# EasyEDA Pro project Optimus Prime.eprj

# Schematic Schematic1
Board Name: Board1; Create Date: 2025-09-30; Page Name: P1; Project Name: Optimus Prime; Schematic Name: Schematic1; Update Date: 2025-09-30; Company: EasyEDA.com; Page Size: A4; Version: V1.0
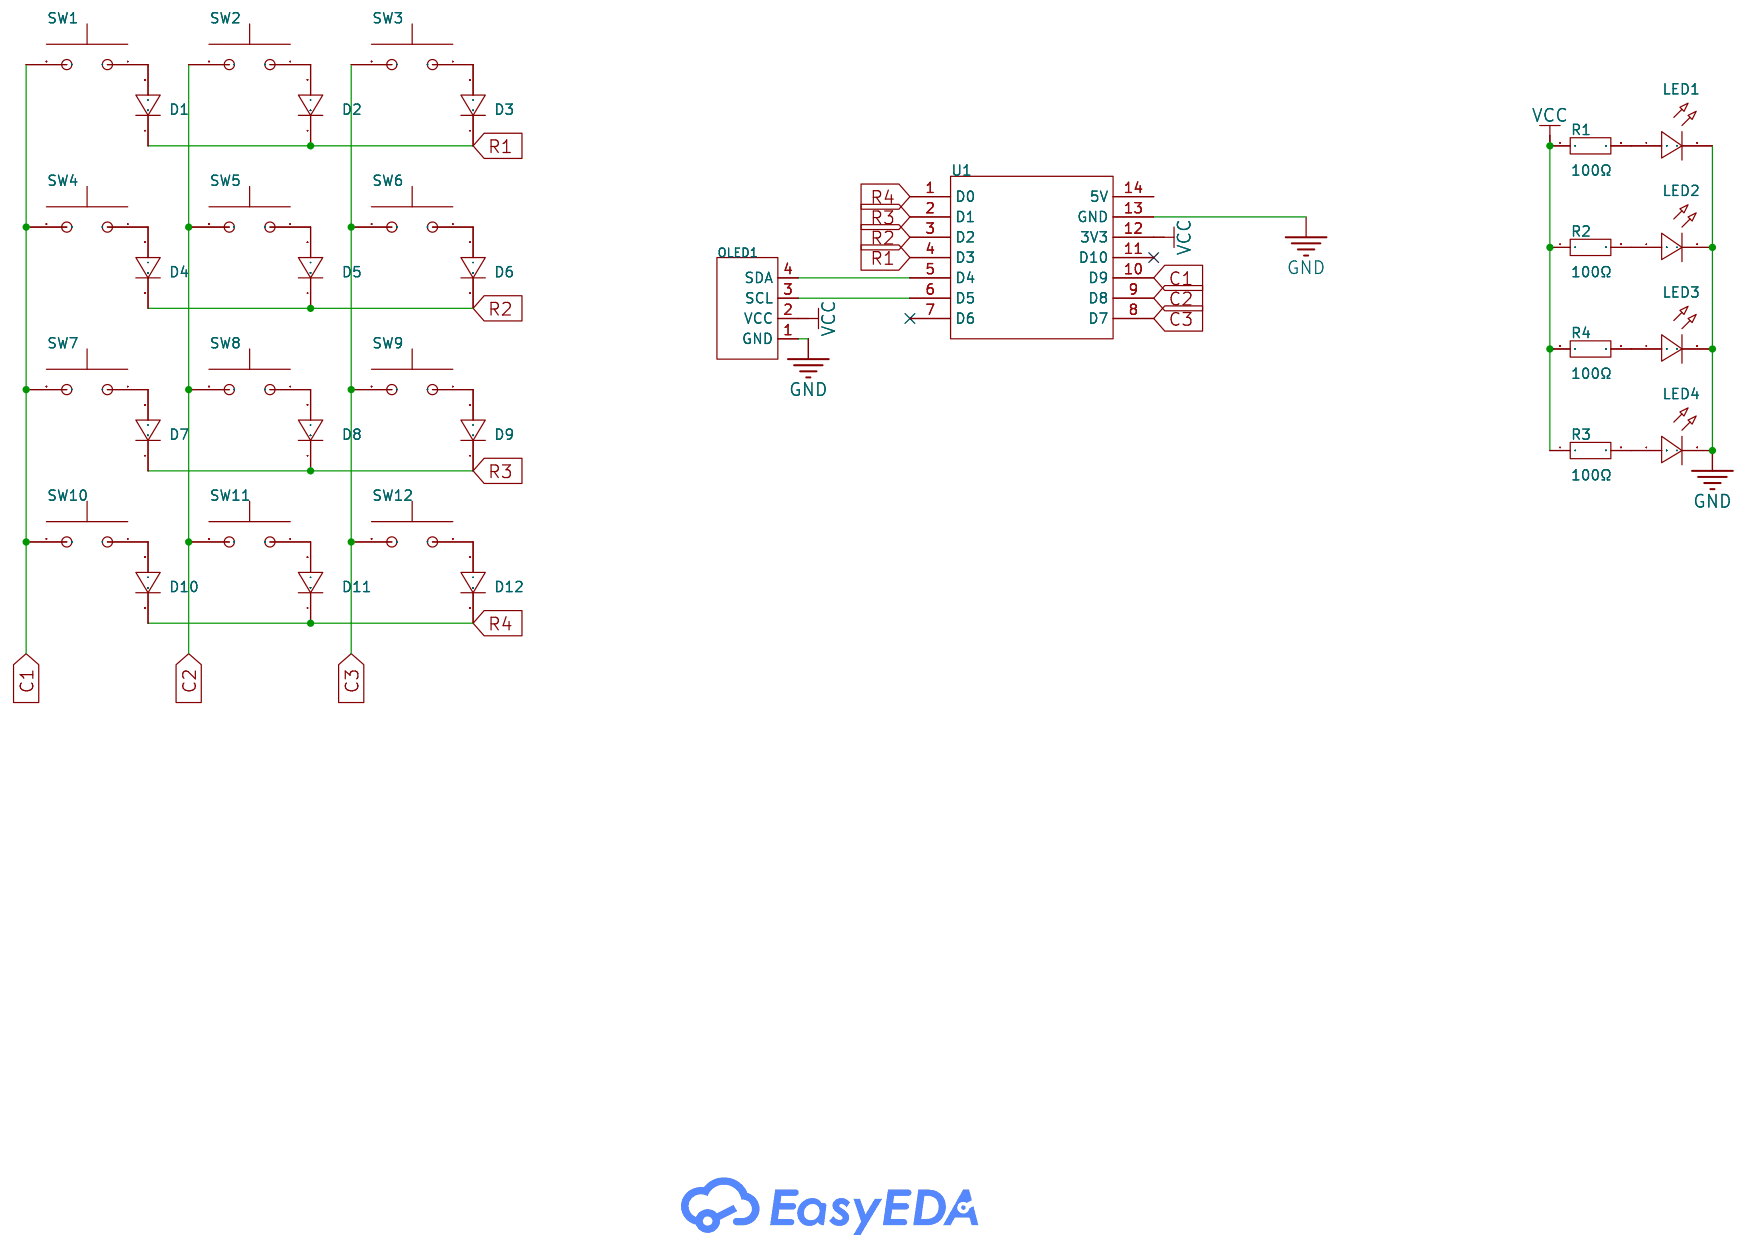
[diagram p0: schematic sheet]

## Parts
D1  1N4148TR  [DO-35_BD2.0-L4.2-P8.20-D0.5-RD]
D2  1N4148TR  [DO-35_BD2.0-L4.2-P8.20-D0.5-RD]
D3  1N4148TR  [DO-35_BD2.0-L4.2-P8.20-D0.5-RD]
D4  1N4148TR  [DO-35_BD2.0-L4.2-P8.20-D0.5-RD]
D5  1N4148TR  [DO-35_BD2.0-L4.2-P8.20-D0.5-RD]
D6  1N4148TR  [DO-35_BD2.0-L4.2-P8.20-D0.5-RD]
D7  1N4148TR  [DO-35_BD2.0-L4.2-P8.20-D0.5-RD]
D8  1N4148TR  [DO-35_BD2.0-L4.2-P8.20-D0.5-RD]
D9  1N4148TR  [DO-35_BD2.0-L4.2-P8.20-D0.5-RD]
D10  1N4148TR  [DO-35_BD2.0-L4.2-P8.20-D0.5-RD]
D11  1N4148TR  [DO-35_BD2.0-L4.2-P8.20-D0.5-RD]
D12  1N4148TR  [DO-35_BD2.0-L4.2-P8.20-D0.5-RD]
LED1  -  [LED-TH_BD3.0-P2.54-FD]
LED2  -  [LED-TH_BD3.0-P2.54-FD]
LED3  -  [LED-TH_BD3.0-P2.54-FD]
LED4  -  [LED-TH_BD3.0-P2.54-FD]
OLED1  HS91L02W2C01  [OLED-TH_L38.0-W12.0_HS91L02W2C01]
R1  100Ω  [RES-TH_BD1.8-L3.2-P7.20-D0.4]
R2  100Ω  [RES-TH_BD1.8-L3.2-P7.20-D0.4]
R3  100Ω  [RES-TH_BD1.8-L3.2-P7.20-D0.4]
R4  100Ω  [RES-TH_BD1.8-L3.2-P7.20-D0.4]
SW1  -  [MX_PCB_1.00u]
SW2  -  [MX_PCB_1.00u]
SW3  -  [MX_PCB_1.00u]
SW4  -  [MX_PCB_1.00u]
SW5  -  [MX_PCB_1.00u]
SW6  -  [MX_PCB_1.00u]
SW7  -  [MX_PCB_1.00u]
SW8  -  [MX_PCB_1.00u]
SW9  -  [MX_PCB_1.00u]
SW10  -  [MX_PCB_1.00u]
SW11  -  [MX_PCB_1.00u]
SW12  -  [MX_PCB_1.00u]
U1  -  [Seeed_XIAO_RP2040]

## Library data of the parts
D1-D12 = 1N4148TR: Diode Configuration:1个独立式 Voltage - Forward(Vf@If):1V@10mA Voltage - DC Reverse(Vr):75V Current - Rectified:300mA Pd - Power Dissipation:500mW Reverse Leakage Current (Ir):5uA@75V Reverse Recovery Time (trr):8ns Operating Junction Temperature Range:-65℃~+; Supplier Part: C84412; Manufacturer: VISHAY(威世); Supplier Footprint: DO-35; Datasheet: https://item.szlcsc.com/datasheet/1N4148TR/85582.html; Supplier: LCSC; Diode Configuration: 1个独立式; Voltage - Forward(Vf@If): 1V@10mA; Voltage - DC Reverse(Vr): 75V; Current - Rectified: 300mA; Pd - Power Dissipation: 500mW; Reverse Leakage Current (Ir): 5uA@75V; Reverse Recovery Time (trr): 8ns; Operating Junction Temperature Range: -65℃~+150℃@(Tj); Non-Repetitive Peak Forward Surge Current: 2A
LED1-LED4 = LED_TH-R_3mm: Supplier Footprint: Through
OLED1 = HS91L02W2C01: Main Control Chip:SSD1306 Interface Type:I2C Size:0.91 Pixel Resolution:128x32 Operating Temperature:-40℃~+70℃ Operating Temperature:-40℃~+70℃; LCSC Part Name: 0.91寸OLED显示屏白光IIC; Supplier Part: C5248081; Manufacturer: HS(汉昇); Datasheet: https://atta.szlcsc.com/upload/public/pdf/source/20230727/C3E43C8E3DDA847F5681FEE7D95C153D.pdf; Supplier: LCSC; Main Control Chip: SSD1306; Interface Type: I2C; Size: 0.91; Pixel Resolution: 128x32; Operating Temperature: -40℃~+70℃
R1-R4 = Res_AXIAL-1/8W: Supplier Footprint: Through
SW1-SW12 = MX_1.00U
U1 = MCU_XIAO_RP2040

## Nets
GND: LED1.2(A) LED2.2(A) LED3.2(A) LED4.2(A) OLED1.1(GND) U1.13(GND)
VCC: OLED1.2(VCC) R1.1 R2.1 R3.1 R4.1 U1.12(3V3)
C1: SW1.2 SW4.2 SW7.2 SW10.2 U1.10(D9)
C2: SW2.2 SW5.2 SW8.2 SW11.2 U1.9(D8)
C3: SW3.2 SW6.2 SW9.2 SW12.2 U1.8(D7)
R1: D1.1(C) D2.1(C) D3.1(C) U1.4(D3)
R2: D4.1(C) D5.1(C) D6.1(C) U1.3(D2)
R3: D7.1(C) D8.1(C) D9.1(C) U1.2(D1)
R4: D10.1(C) D11.1(C) D12.1(C) U1.1(D0)
$1N594: D1.2(A) SW1.1
$1N635: D2.2(A) SW2.1
$1N676: D3.2(A) SW3.1
$1N957: D4.2(A) SW4.1
$1N959: D5.2(A) SW5.1
$1N961: D6.2(A) SW6.1
$1N1080: D7.2(A) SW7.1
$1N1082: D8.2(A) SW8.1
$1N1092: D9.2(A) SW9.1
$1N1238: OLED1.4(SDA) U1.5(D4)
$1N1242: OLED1.3(SCL) U1.6(D5)
$1N1438: D10.2(A) SW10.1
$1N1440: D11.2(A) SW11.1
$1N1442: D12.2(A) SW12.1
$1N1843: LED1.1(C) R1.2
$1N1845: LED2.1(C) R2.2
$1N2019: LED3.1(C) R4.2
$1N2021: LED4.1(C) R3.2

Not connected (* = marked no-connect by the designer): U1 7(D6)* 11(D10)* 14(5V)

# Board PCB1
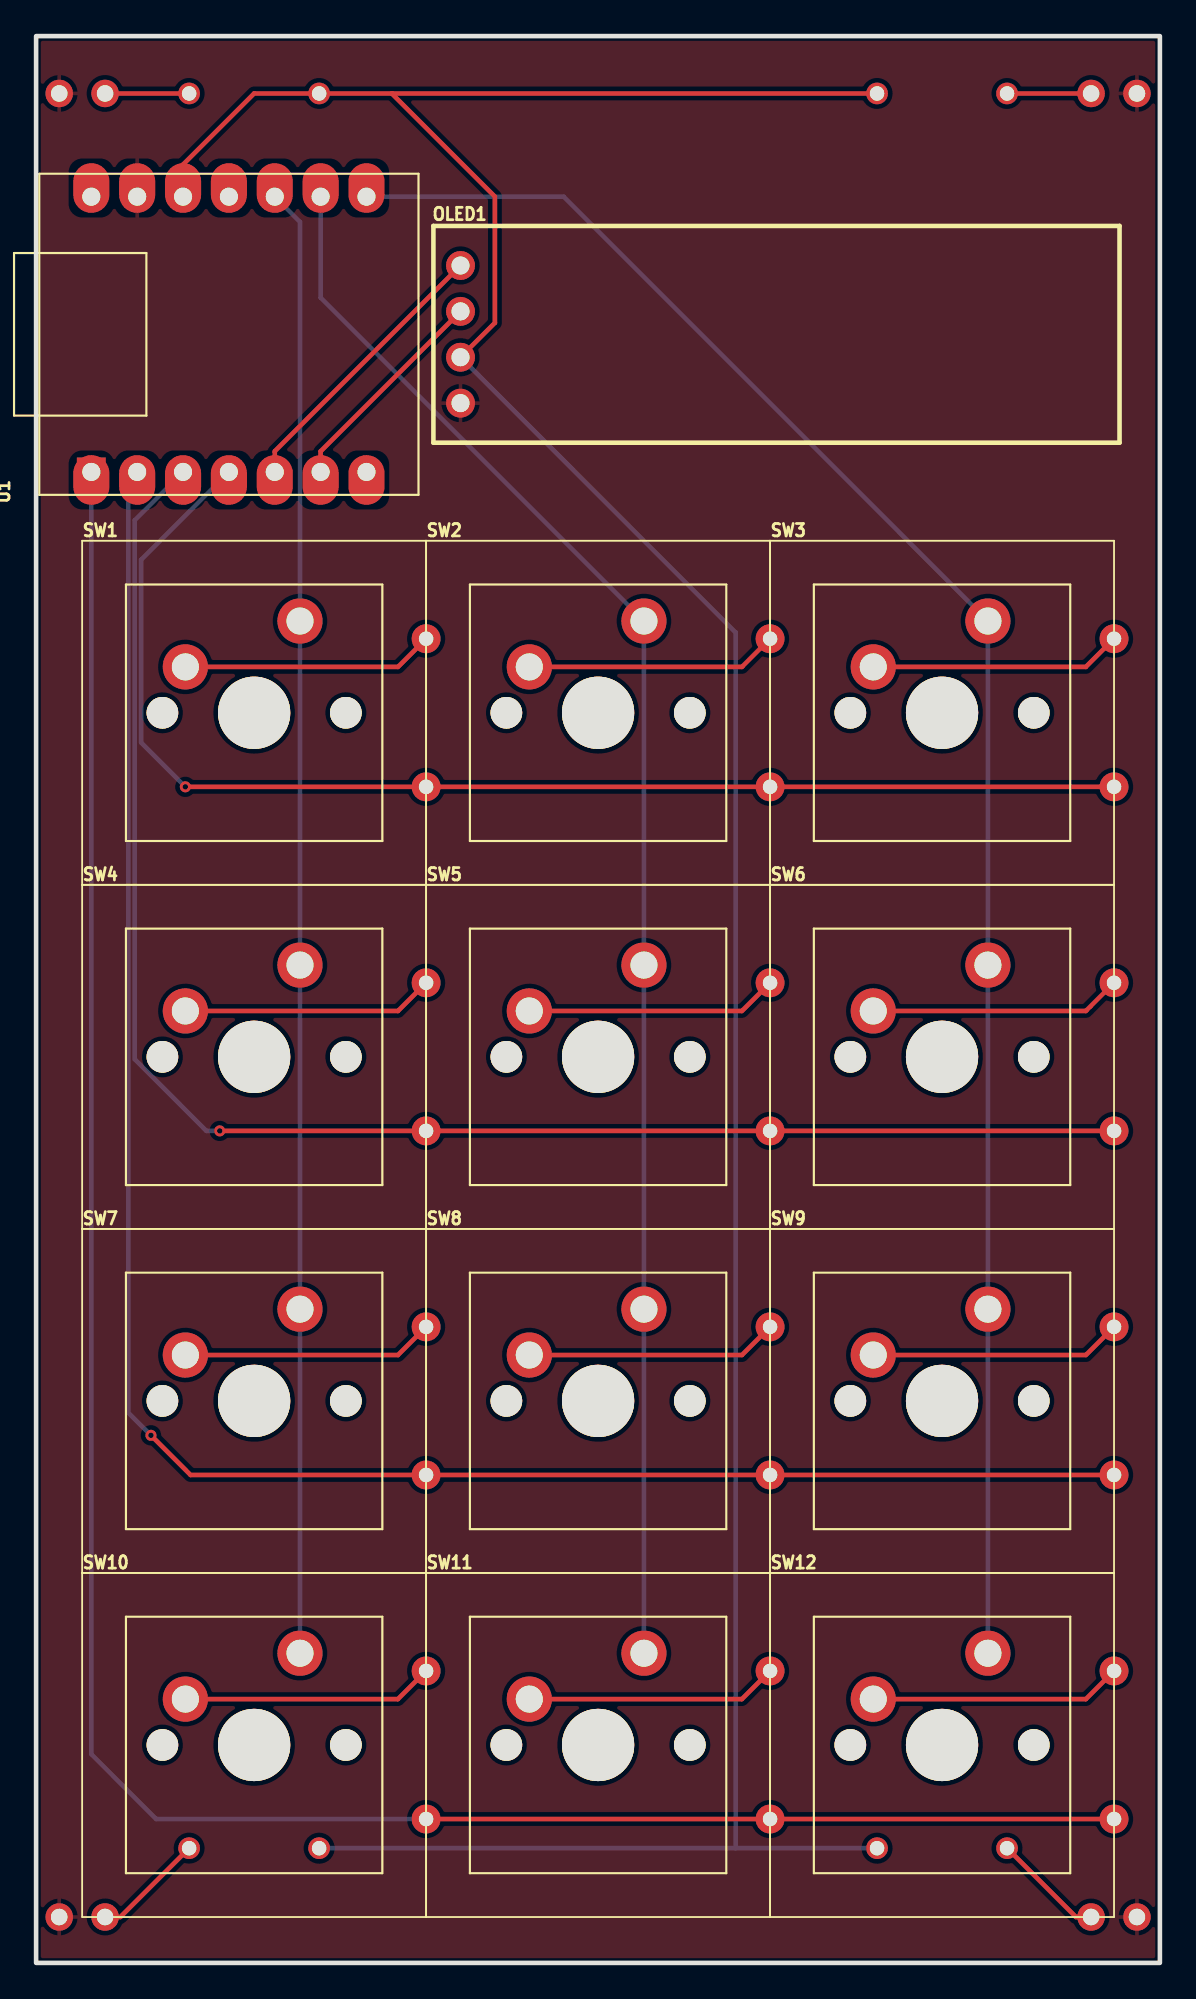
[diagram p1: board, top side]
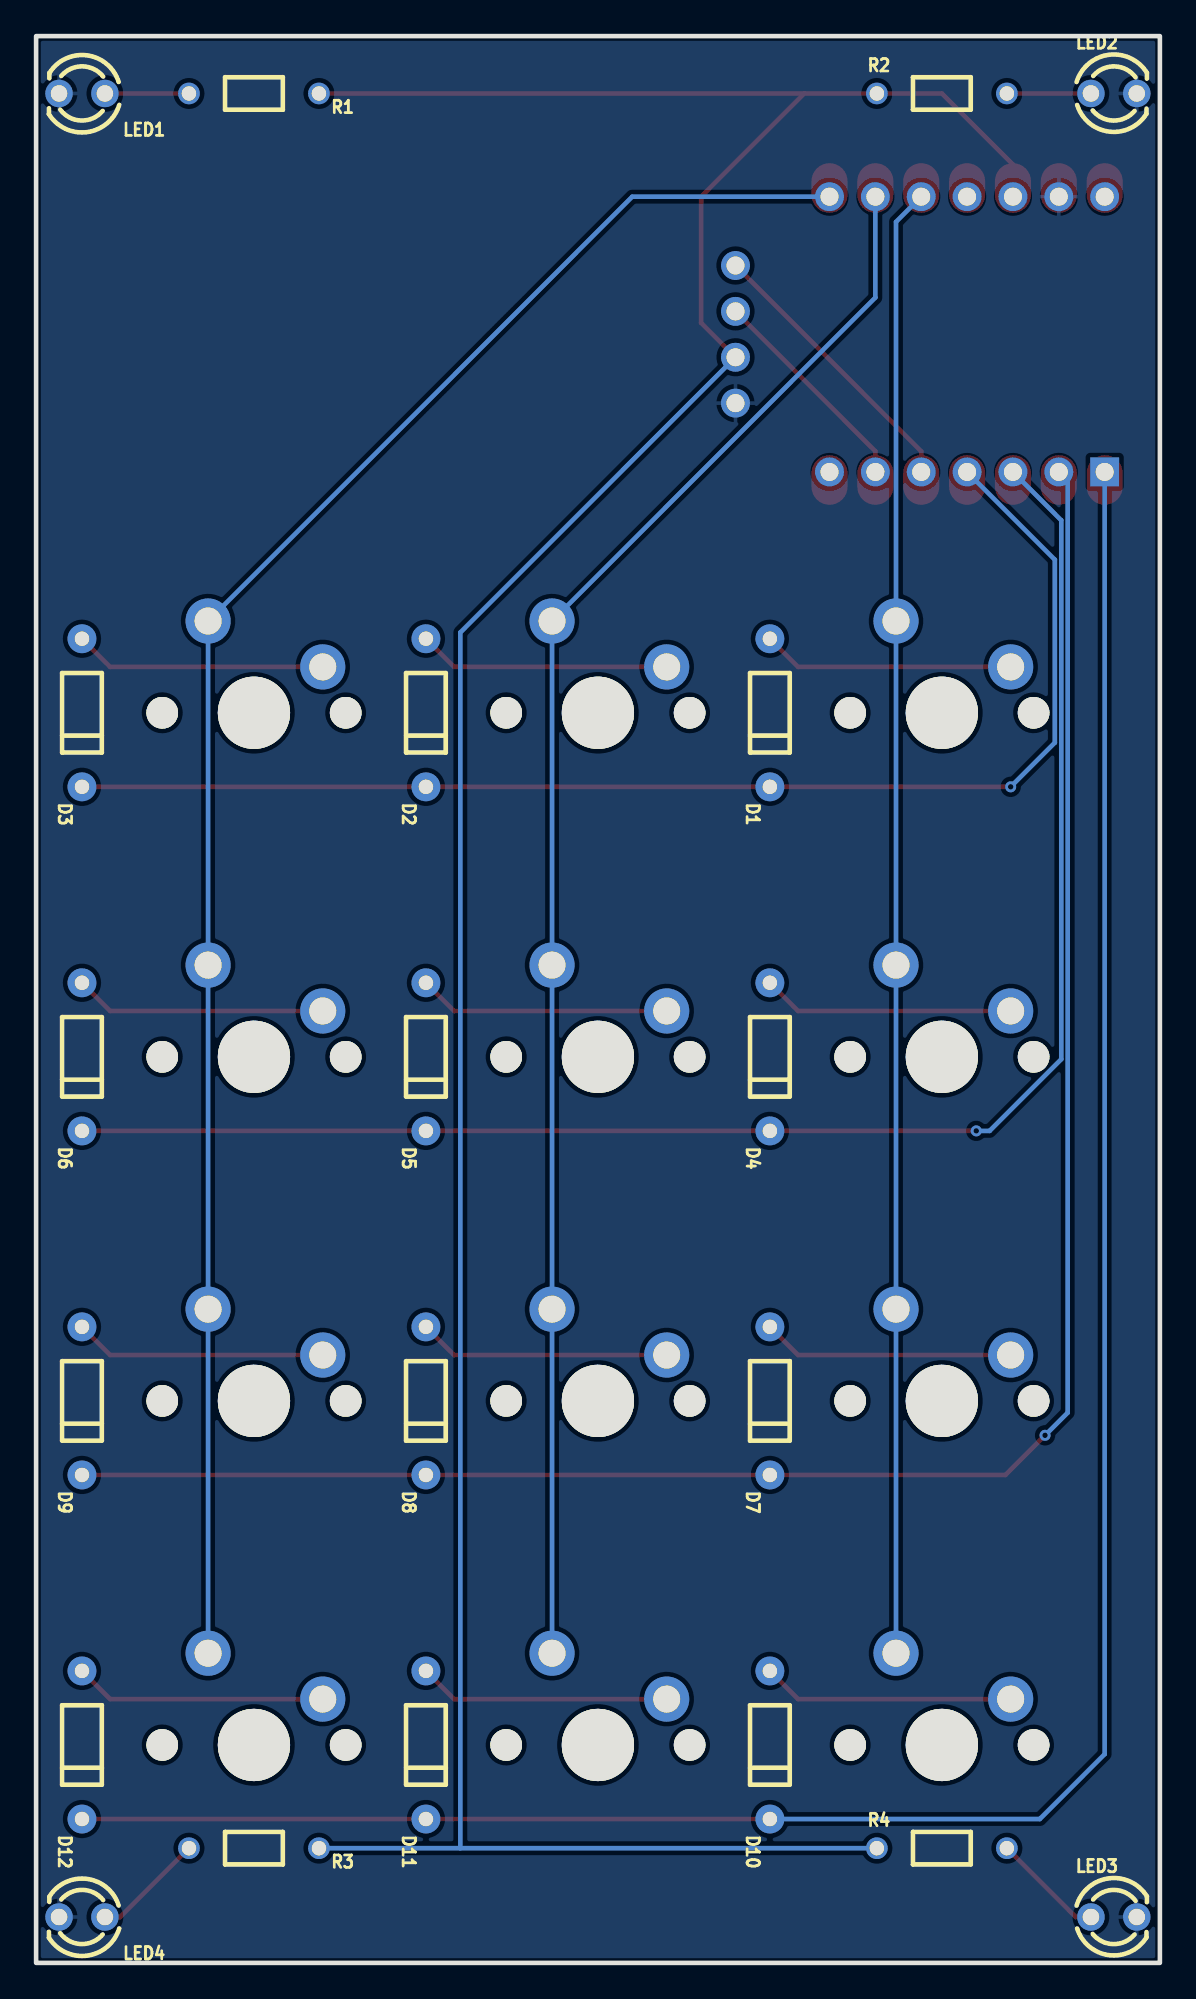
[diagram p2: board, bottom side, seen from below]

Outline 62.24 x 106.68 mm; copper layers: Top Layer, Bottom Layer. Coordinates in mm from the lower left corner of the outline.
Outline path: rectangle 0,106.68 62.24,0
Stack: Top Layer 0.035mm / Dielectric1 1.51mm FR4 er 4.5 / Bottom Layer 0.035mm

## Design rules (mm)
template: JLCPCB Capability(Two Layers Board)
spacing copperThickness1oz (default): track to track 0.102, other pairs 0.152 to 0.3
spacing copperThickness2oz: track to track 0.203, other pairs 0.152 to 0.3
track width copperThickness1oz (default): min 0.127, default 0.254, max 2.54
track width copperThickness2oz: min 0.203, default 0.254, max 2.54
differential pair differentialPair (default): width min 0.127, default 0.254, max 2.54; gap min 0.152, default 0.152
via viaSize (default): diameter min 0.5, default 0.61, max 10; hole min 0.3, default 0.305, max 6.3

## Placement (name value [footprint] x y rotation side)
D1  1N4148TR  [DO-35_BD2.0-L4.2-P8.20-D0.5-RD]  21.6 69.21 90 bottom
D2  1N4148TR  [DO-35_BD2.0-L4.2-P8.20-D0.5-RD]  40.65 69.21 90 bottom
D3  1N4148TR  [DO-35_BD2.0-L4.2-P8.20-D0.5-RD]  59.7 69.21 90 bottom
D4  1N4148TR  [DO-35_BD2.0-L4.2-P8.20-D0.5-RD]  21.6 50.16 90 bottom
D5  1N4148TR  [DO-35_BD2.0-L4.2-P8.20-D0.5-RD]  40.65 50.16 90 bottom
D6  1N4148TR  [DO-35_BD2.0-L4.2-P8.20-D0.5-RD]  59.7 50.16 90 bottom
D7  1N4148TR  [DO-35_BD2.0-L4.2-P8.20-D0.5-RD]  21.6 31.11 90 bottom
D8  1N4148TR  [DO-35_BD2.0-L4.2-P8.20-D0.5-RD]  40.65 31.11 90 bottom
D9  1N4148TR  [DO-35_BD2.0-L4.2-P8.20-D0.5-RD]  59.7 31.11 90 bottom
D10  1N4148TR  [DO-35_BD2.0-L4.2-P8.20-D0.5-RD]  21.6 12.06 90 bottom
D11  1N4148TR  [DO-35_BD2.0-L4.2-P8.20-D0.5-RD]  40.65 12.06 90 bottom
D12  1N4148TR  [DO-35_BD2.0-L4.2-P8.20-D0.5-RD]  59.7 12.06 90 bottom
LED1  -  [LED-TH_BD3.0-P2.54-FD]  59.7 103.5 0 bottom
LED2  -  [LED-TH_BD3.0-P2.54-FD]  2.55 103.5 180 bottom
LED3  -  [LED-TH_BD3.0-P2.54-FD]  2.55 2.54 180 bottom
LED4  -  [LED-TH_BD3.0-P2.54-FD]  59.7 2.54 0 bottom
OLED1  HS91L02W2C01  [OLED-TH_L38.0-W12.0_HS91L02W2C01]  23.5 90.17 0 top
R1  100Ω  [RES-TH_BD1.8-L3.2-P7.20-D0.4]  50.18 103.5 0 bottom
R2  100Ω  [RES-TH_BD1.8-L3.2-P7.20-D0.4]  12.07 103.5 180 bottom
R3  100Ω  [RES-TH_BD1.8-L3.2-P7.20-D0.4]  50.18 6.35 0 bottom
R4  100Ω  [RES-TH_BD1.8-L3.2-P7.20-D0.4]  12.07 6.35 180 bottom
SW1  -  [MX_PCB_1.00u]  12.07 69.21 0 top
SW2  -  [MX_PCB_1.00u]  31.12 69.21 0 top
SW3  -  [MX_PCB_1.00u]  50.18 69.21 0 top
SW4  -  [MX_PCB_1.00u]  12.07 50.16 0 top
SW5  -  [MX_PCB_1.00u]  31.12 50.16 0 top
SW6  -  [MX_PCB_1.00u]  50.18 50.16 0 top
SW7  -  [MX_PCB_1.00u]  12.07 31.11 0 top
SW8  -  [MX_PCB_1.00u]  31.12 31.11 0 top
SW9  -  [MX_PCB_1.00u]  50.18 31.11 0 top
SW10  -  [MX_PCB_1.00u]  12.07 12.06 0 top
SW11  -  [MX_PCB_1.00u]  31.12 12.06 0 top
SW12  -  [MX_PCB_1.00u]  50.18 12.06 0 top
U1  -  [Seeed_XIAO_RP2040]  10.68 90.17 90 top

## Footprints (pads in the part's own frame, mm; a bottom-side part is the same pattern mirrored in y, then rotated)
DO-35_BD2.0-L4.2-P8.20-D0.5-RD
  round 1.6 hole 0.8: 1(-4.1,0) 2(4.1,0)
LED-TH_BD3.0-P2.54-FD
  round 1.524 hole 0.914: 1(-1.27,0) 2(1.27,0)
MX_PCB_1.00u
  round 1.75 hole 1.75: (-5.08,0) (5.08,0)
  round 4 hole 4: (0,0)
  round 2.5 hole 1.5: 1(-3.81,2.54) 2(2.54,5.08)
OLED-TH_L38.0-W12.0_HS91L02W2C01
  round 1.6 hole 1: 1(0,-3.81) 2(0,-1.27) 3(0,1.27) 4(0,3.81)
RES-TH_BD1.8-L3.2-P7.20-D0.4
  round 1.2 hole 0.8: 1(-3.6,0) 2(3.6,0)
Seeed_XIAO_RP2040
  rrect 2.75x2 smd: 1(-8.065,7.62) 2(-8.065,5.08) 3(-8.065,2.54) 4(-8.065,0) 5(-8.065,-2.54) 6(-8.065,-5.08) 7(-8.065,-7.62) 8(8.1,-7.62) 9(8.1,-5.08) 10(8.1,-2.54) 11(8.1,0) 12(8.1,2.54) 13(8.1,5.08) 14(8.1,7.62)
  rect 1.6x1.6 hole 1: 1(-7.62,7.62)
  round 1.6 hole 1: 2(-7.62,5.08) 3(-7.62,2.54) 4(-7.62,0) 5(-7.62,-2.54) 6(-7.62,-5.08) 7(-7.62,-7.62) 8(7.62,-7.62) 9(7.62,-5.08) 10(7.62,-2.54) 11(7.62,0) 12(7.62,2.54) 13(7.62,5.08) 14(7.62,7.62)

## Nets
As in the schematic.

Pads without a net: U1 7 11 14

## Via types
v1: diameter 0.61, hole 0.305, Top Layer to Bottom Layer, 3 vias

## Routing (per net, layer and track width the routed paths; a pad name or vN(x,y) marks a point on that pad's centre or on a via; arc(x,y) is an arc through that point)
VCC: length 179.4
  Top Layer w0.254: 19.69,103.5 25.41,97.79 25.41,90.8 OLED1.2 ; 19.69,103.5 R2.1 12.07,103.5 8.14,99.57 U1.12 ; 19.69,103.5 R1.1
  Bottom Layer w0.254: 38.75,6.35 R3.1 ; 38.75,6.35 38.75,73.66 OLED1.2 ; 38.75,6.35 R4.1
C1: length 81.2
  Bottom Layer w0.254: U1.10 14.62,96.39 SW1.2 SW4.2 14.62,17.14
C2: length 88.1
  Bottom Layer w0.254: 33.66,17.14 SW5.2 SW2.2 15.76,92.2 U1.9
C3: length 101.3
  Bottom Layer w0.254: 52.72,17.14 SW6.2 SW3.2 29.22,97.79 U1.8
R1: length 71.9
  Top Layer w0.254: v1(8.27,65.11) D1.1 D2.1 D3.1
  Bottom Layer w0.254: v1(8.27,65.11) 5.82,67.56 5.82,77.69 U1.4
R2: length 89.5
  Top Layer w0.254: v1(10.17,46.06) 59.7,46.06
  Bottom Layer w0.254: U1.3 5.46,79.87 5.46,50.03 9.43,46.06 v1(10.17,46.06)
R3: length 108.3
  Top Layer w0.254: D9.1 D8.1 D7.1 8.56,27.01 v1(6.36,29.21)
  Bottom Layer w0.254: U1.2 5.11,82.06 5.11,30.46 v1(6.36,29.21)
R4: length 129.1
  Top Layer w0.254: 21.6,7.96 59.7,7.96
  Bottom Layer w0.254: 21.6,7.96 6.65,7.96 3.06,11.56 U1.1
$1N594: length 14
  Top Layer w0.254: D1.2 20.04,71.75 SW1.1
$1N635: length 14
  Top Layer w0.254: SW2.1 39.09,71.75 D2.2
$1N676: length 14
  Top Layer w0.254: D3.2 58.14,71.75 SW3.1
$1N957: length 14
  Top Layer w0.254: 8.27,52.7 20.04,52.7 D4.2
$1N959: length 14
  Top Layer w0.254: 27.31,52.7 39.09,52.7 D5.2
$1N961: length 14
  Top Layer w0.254: D6.2 58.14,52.7 46.37,52.7
$1N1080: length 14
  Top Layer w0.254: 21.6,35.21 20.04,33.65 SW7.1
$1N1082: length 14
  Top Layer w0.254: 40.65,35.21 39.09,33.65 SW8.1
$1N1092: length 14
  Top Layer w0.254: SW9.1 58.14,33.65 59.7,35.21
$1N1238: length 15.7
  Top Layer w0.254: U1.5 13.22,83.69 OLED1.4
$1N1242: length 12.1
  Top Layer w0.254: OLED1.3 15.76,83.69 U1.6
$1N1438: length 14
  Top Layer w0.254: SW10.1 20.04,14.6 D10.2
$1N1440: length 14
  Top Layer w0.254: D11.2 39.09,14.6 SW11.1
$1N1442: length 14
  Top Layer w0.254: D12.2 58.14,14.6 SW12.1
$1N1843: length 4.7
  Top Layer w0.254: R1.2 LED1.1
$1N1845: length 4.7
  Top Layer w0.254: LED2.1 R2.2
$1N2019: length 6.2
  Top Layer w0.254: LED3.1 4.67,2.54 R4.2
$1N2021: length 6.2
  Top Layer w0.254: LED4.1 57.59,2.54 R3.2

## Copper pours and planes (outline as drawn; the poured copper is in the pictures)
GND on Top Layer: -6.97,111.12 71.13,111.12 71.13,-1.27 -6.97,-1.27
GND on Bottom Layer: -6.97,109.22 71.13,109.22 71.13,-3.18 -6.97,-3.18
